# Altium schematic sheet LTC6803.SchDoc
size A
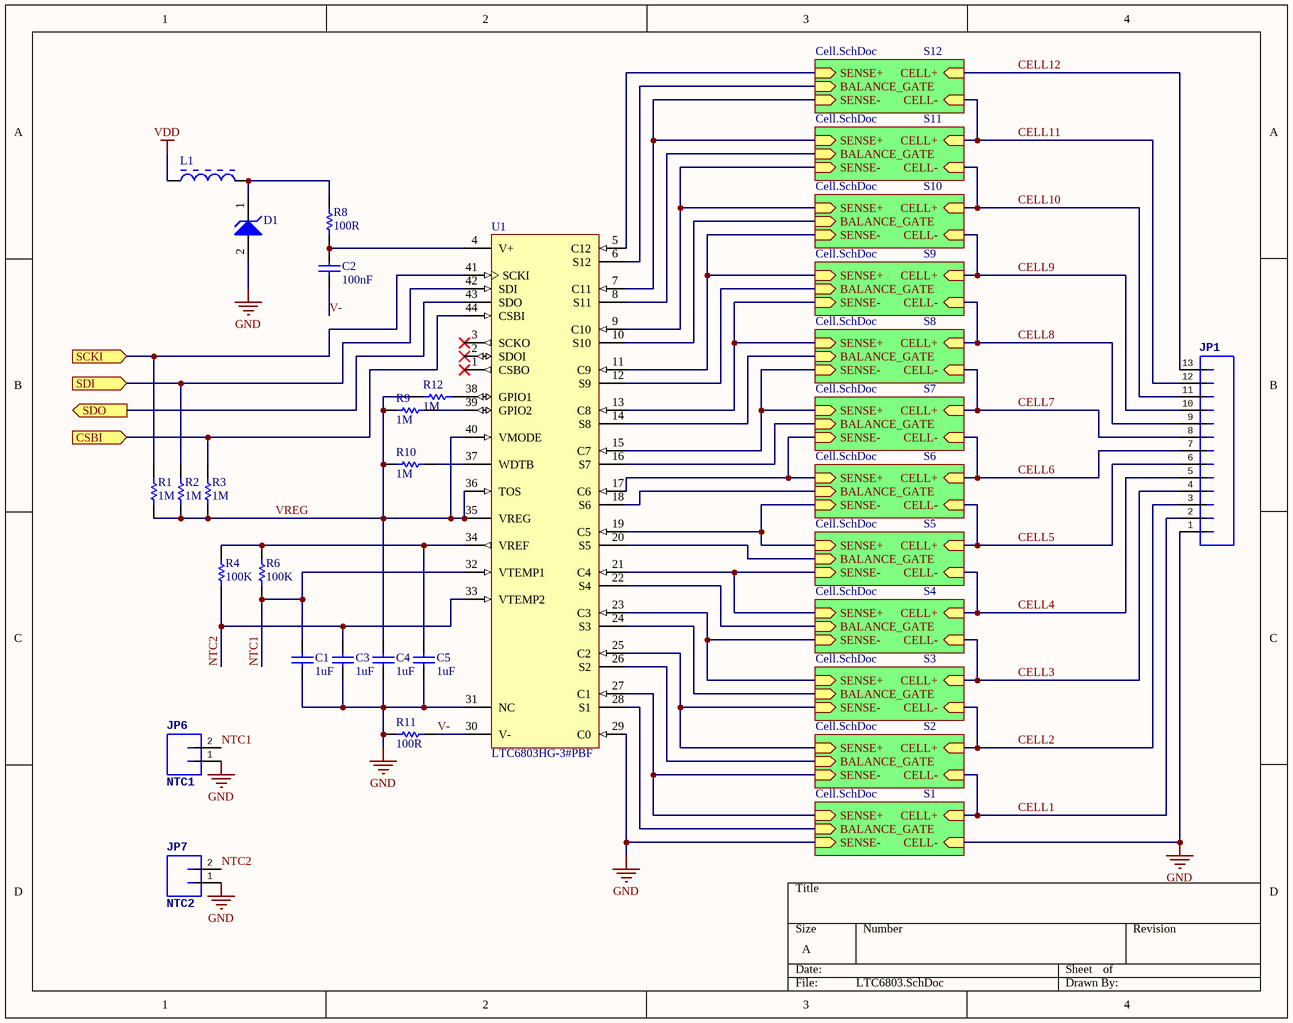
[diagram p0: LTC6803.SchDoc]

## Parts
C1  1uF  [CAPC0603(1608)100_N]
C2  100nF  [CAPC0603(1608)100_L]
C3  1uF  [CAPC0603(1608)100_N]
C4  1uF  [CAPC0603(1608)100_N]
C5  1uF  [CAPC0603(1608)100_N]
D1  (no value)  [SOD-123]
JP1  (no value)  [JST-13-PTH-VERT]
JP6  NTC1  [JST-2-PTH-VERT]
JP7  NTC2  [JST-2-PTH-VERT]
L1  (no value)  [MURA-BLM31-B60-CHIP-2_V3]
R1  1M  [RESC0603(1608)_L]
R2  1M  [RESC0603(1608)_L]
R3  1M  [RESC0603(1608)_L]
R4  100K  [RESC0603(1608)_N]
R6  100K  [RESC0603(1608)_N]
R8  100R  [RESC0603(1608)_L]
R9  1M  [RESC0603(1608)_L]
R10  1M  [RESC0603(1608)_L]
R11  100R  [RESC0603(1608)_L]
R12  1M  [RESC0603(1608)_L]
U1  LTC6803HG-3#PBF  [LT-G-44_L]

## Sub-sheets
S1 = Cell.SchDoc: CELL- (in), SENSE+, SENSE-, BALANCE_GATE (in), CELL+ (in)
S2 = Cell.SchDoc: CELL- (in), SENSE+, SENSE-, BALANCE_GATE (in), CELL+ (in)
S3 = Cell.SchDoc: CELL- (in), SENSE+, SENSE-, BALANCE_GATE (in), CELL+ (in)
S4 = Cell.SchDoc: CELL- (in), SENSE+, SENSE-, BALANCE_GATE (in), CELL+ (in)
S5 = Cell.SchDoc: CELL- (in), SENSE+, SENSE-, BALANCE_GATE (in), CELL+ (in)
S6 = Cell.SchDoc: CELL- (in), SENSE+, SENSE-, BALANCE_GATE (in), CELL+ (in)
S7 = Cell.SchDoc: CELL- (in), SENSE+, SENSE-, BALANCE_GATE (in), CELL+ (in)
S8 = Cell.SchDoc: CELL- (in), SENSE+, SENSE-, BALANCE_GATE (in), CELL+ (in)
S9 = Cell.SchDoc: CELL- (in), SENSE+, SENSE-, BALANCE_GATE (in), CELL+ (in)
S10 = Cell.SchDoc: CELL- (in), SENSE+, SENSE-, BALANCE_GATE (in), CELL+ (in)
S11 = Cell.SchDoc: CELL- (in), SENSE+, SENSE-, BALANCE_GATE (in), CELL+ (in)
S12 = Cell.SchDoc: CELL- (in), SENSE+, SENSE-, BALANCE_GATE (in), CELL+ (in)

## Ports
CSBI (in), SCKI (in), SDI (in), SDO (out)

## Nets
GND: C1.1 C3.1 C4.1 C5.1 D1.2(A) JP1.1 JP6.1 JP7.1 R11.1 U1.29(C0) U1.31(NC) ; sheet S1/CELL-, sheet S1/SENSE-
VDD: L1.1
CELL1: JP1.2 ; sheet S2/CELL-, sheet S1/CELL+
CELL2: JP1.3 ; sheet S3/CELL-, sheet S2/CELL+
CELL3: JP1.4 ; sheet S4/CELL-, sheet S3/CELL+
CELL4: JP1.5 ; sheet S5/CELL-, sheet S4/CELL+
CELL5: JP1.6 ; sheet S6/CELL-, sheet S5/CELL+
CELL6: JP1.7 ; sheet S7/CELL-, sheet S6/CELL+
CELL7: JP1.8 ; sheet S8/CELL-, sheet S7/CELL+
CELL8: JP1.9 ; sheet S9/CELL-, sheet S8/CELL+
CELL9: JP1.10 ; sheet S10/CELL-, sheet S9/CELL+
CELL10: JP1.11 ; sheet S11/CELL-, sheet S10/CELL+
CELL11: JP1.12 ; sheet S12/CELL-, sheet S11/CELL+
CELL12: JP1.13 ; sheet S12/CELL+
CSBI: R3.2 U1.44(CSBI) ; port CSBI
NTC1: C1.2 JP6.2 R6.1 U1.32(VTEMP1)
NTC2: C3.2 JP7.2 R4.1 U1.33(VTEMP2)
SCKI: R1.2 U1.41(SCKI) ; port SCKI
SDI: R2.2 U1.42(SDI) ; port SDI
SDO: U1.43(SDO) ; port SDO
V-: C2.1 R11.2 U1.30(V-)
VREG: C4.2 R1.1 R2.1 R3.1 R9.1 R10.1 R12.1 U1.35(VREG) U1.36(TOS) U1.40(VMODE)
NetC2_2: C2.2 R8.1 U1.4(V+)
NetC5_2: C5.2 R4.2 R6.2 U1.34(VREF)
NetD1_1: D1.1(K) L1.2 R8.2
NetR9_2: R9.2 U1.39(GPIO2)
NetR10_2: R10.2 U1.37(WDTB)
NetR12_2: R12.2 U1.38(GPIO1)
NetU1_5: U1.5(C12) ; sheet S12/SENSE+
NetU1_6: U1.6(S12) ; sheet S12/BALANCE_GATE
NetU1_7: U1.7(C11) ; sheet S12/SENSE-, sheet S11/SENSE+
NetU1_8: U1.8(S11) ; sheet S11/BALANCE_GATE
NetU1_9: U1.9(C10) ; sheet S11/SENSE-, sheet S10/SENSE+
NetU1_10: U1.10(S10) ; sheet S10/BALANCE_GATE
NetU1_11: U1.11(C9) ; sheet S10/SENSE-, sheet S9/SENSE+
NetU1_12: U1.12(S9) ; sheet S9/BALANCE_GATE
NetU1_13: U1.13(C8) ; sheet S9/SENSE-, sheet S8/SENSE+
NetU1_14: U1.14(S8) ; sheet S8/BALANCE_GATE
NetU1_15: U1.15(C7) ; sheet S8/SENSE-, sheet S7/SENSE+
NetU1_16: U1.16(S7) ; sheet S7/BALANCE_GATE
NetU1_17: U1.17(C6) ; sheet S7/SENSE-, sheet S6/SENSE+
NetU1_18: U1.18(S6) ; sheet S6/BALANCE_GATE
NetU1_19: U1.19(C5) ; sheet S6/SENSE-, sheet S5/SENSE+
NetU1_20: U1.20(S5) ; sheet S5/BALANCE_GATE
NetU1_21: U1.21(C4) ; sheet S5/SENSE-, sheet S4/SENSE+
NetU1_22: U1.22(S4) ; sheet S4/BALANCE_GATE
NetU1_23: U1.23(C3) ; sheet S4/SENSE-, sheet S3/SENSE+
NetU1_24: U1.24(S3) ; sheet S3/BALANCE_GATE
NetU1_25: U1.25(C2) ; sheet S3/SENSE-, sheet S2/SENSE+
NetU1_26: U1.26(S2) ; sheet S2/BALANCE_GATE
NetU1_27: U1.27(C1) ; sheet S2/SENSE-, sheet S1/SENSE+
NetU1_28: U1.28(S1) ; sheet S1/BALANCE_GATE

Not connected (* = marked no-connect by the designer): U1 1(CSBO)* 2(SDOI)* 3(SCKO)*

## Library data of the parts
C1 C3-C5 = CMP-1035-02730-1: CAP 1uF 6.3V Â±10% 0603 (1608 Metric) Thickness 1mm SMD; Case-EIA: 0603; Case-Metric: 1608; Rated Voltage: 6.3 V; Max Thickness: 1 mm; Technology: SMT; Tolerance: Â±10%; Value: 1uF
C2 = CMP-1035-02595-1: CAP 100nF 100V Â±10% 0603 (1608 Metric) Thickness 1mm SMD; Case-EIA: 0603; Case-Metric: 1608; Tolerance: Â±10%; Rated Voltage: 100 V; Value: 100nF; Technology: SMT; Max Thickness: 1 mm
D1 = CMHZ5265B
JP1 = JST_XH_13
JP6 JP7 = JST_2_VERT
L1 = MURA-FB-2
R1-R3 R9 R10 R12 = CMP-1012-00849-1: 1M 0.1W 1% 0603 (1608 Metric)  SMD; Value: 1000000.00 Ohm; Case-EIA: 0603; Case-Metric: 1608; Power: 0.1 W; Tolerance: 1 %; Technology: SMT
R4 R6 = CMP-1012-00122-1: 100K 0.1W 5% 0603 (1608 Metric)  SMD; Case-EIA: 0603; Value: 100000.00 Ohm; Case-Metric: 1608; Tolerance: 5 %; Power: 0.1 W; Technology: SMT
R8 R11 = CMP-1012-00050-1: 100R 0.1W 5% 0603 (1608 Metric)  SMD; Case-EIA: 0603; Value: 100.00 Ohm; Case-Metric: 1608; Tolerance: 5 %; Technology: SMT; Power: 0.1 W
U1 = CMP-0471-00238-1: Multicell Battery Stack Monitor, 60 V Vin MAX, 44-pin SOP (G-44), -40 to 125 degC, Pb-Free; Manufacturer: Linear Technology; Number of Cells: > 1000 V of stacked Li-Ion cells; Vin Max(V): 60; Battery Chemistry: Li-Ion, Supercapacitors, Multi-Chemistry; ComponentLink2URL: http://cds.linear.com/docs/en/datasheet/680313fa.pdf; ComponentLink1URL: http://www.linear.com/; PackageReference: G-44; DatasheetVersion: Rev. A; RoHS: TRUE; Mounting Technology: Surface Mount; ComponentLink3Description: Package Specification; PartNumber: LTC6803HG-3#PBF; Type of Charger: Battery Stack Monitor; PackageVersion: Rev. Ã˜, 06/2010; ComponentLink1Description: Manufacturer URL; PackageDescription: 44-Pin Plastic SSOP, Body 12.8 x 5.3 mm, Pitch 0.5 mm; ComponentLink3URL: http://cds.linear.com/docs/en/packaging/SSOP_44_05-08-1754.pdf; ComponentLink2Description: Datasheet